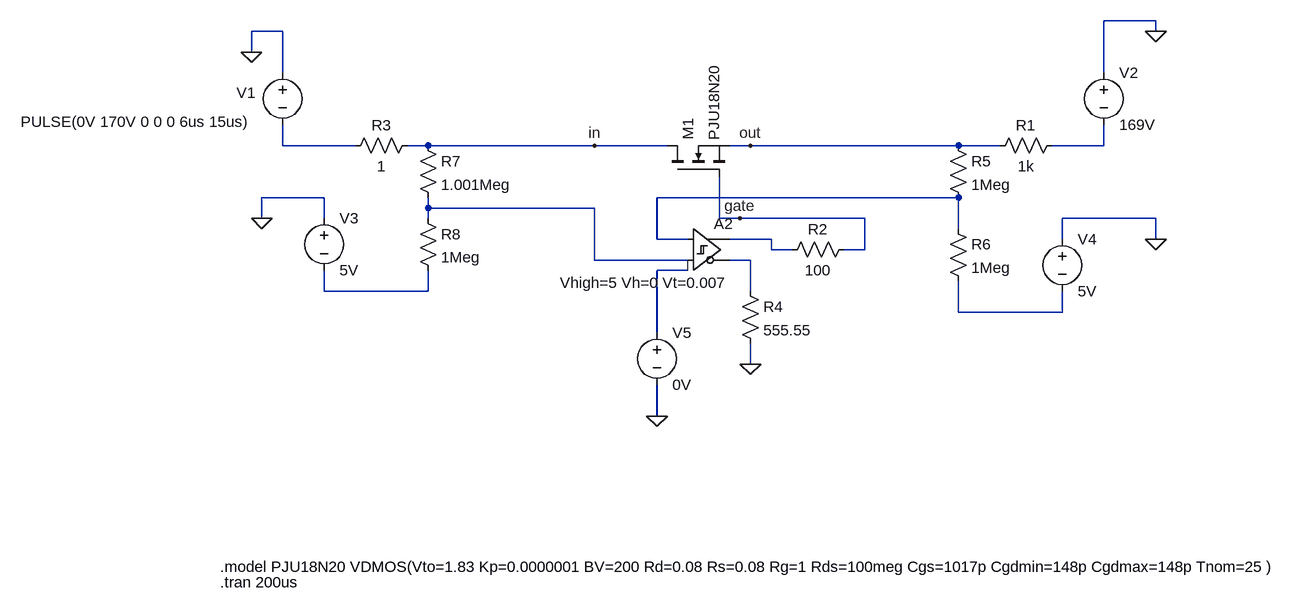
[diagram p0: schematic ideal diode 2.asc]
ideal diode 2.asc, the LTspice schematic file:
Version 4
SHEET 1 2104 680
WIRE 1648 -464 1568 -464
WIRE 304 -448 256 -448
WIRE 1648 -448 1648 -464
WIRE 256 -416 256 -448
WIRE 304 -384 304 -448
WIRE 1568 -384 1568 -464
WIRE 304 -272 304 -304
WIRE 416 -272 304 -272
WIRE 528 -272 496 -272
WIRE 784 -272 528 -272
WIRE 896 -272 784 -272
WIRE 1024 -272 992 -272
WIRE 1344 -272 1024 -272
WIRE 1408 -272 1344 -272
WIRE 1568 -272 1568 -304
WIRE 1568 -272 1488 -272
WIRE 368 -192 272 -192
WIRE 1344 -192 880 -192
WIRE 528 -176 528 -192
WIRE 784 -176 528 -176
WIRE 272 -160 272 -192
WIRE 368 -160 368 -192
WIRE 528 -160 528 -176
WIRE 976 -160 976 -224
WIRE 1008 -160 976 -160
WIRE 1200 -160 1008 -160
WIRE 1648 -160 1504 -160
WIRE 1344 -144 1344 -192
WIRE 880 -128 880 -192
WIRE 928 -128 880 -128
WIRE 1056 -128 992 -128
WIRE 1504 -128 1504 -160
WIRE 1648 -128 1648 -160
WIRE 1056 -112 1056 -128
WIRE 1088 -112 1056 -112
WIRE 1200 -112 1200 -160
WIRE 1200 -112 1168 -112
WIRE 784 -96 784 -176
WIRE 928 -96 784 -96
WIRE 1024 -96 992 -96
WIRE 928 -80 880 -80
WIRE 368 -48 368 -80
WIRE 528 -48 528 -80
WIRE 528 -48 368 -48
WIRE 1024 -48 1024 -96
WIRE 1344 -16 1344 -64
WIRE 1504 -16 1504 -48
WIRE 1504 -16 1344 -16
WIRE 880 16 880 -80
WIRE 1024 64 1024 32
WIRE 880 144 880 96
FLAG 1648 -448 0
FLAG 256 -416 0
FLAG 880 144 0
FLAG 1024 64 0
FLAG 784 -272 in
FLAG 1024 -272 out
FLAG 1008 -160 gate
FLAG 272 -160 0
FLAG 1648 -128 0
SYMBOL nmos 896 -224 R270
SYMATTR InstName M1
SYMATTR Value PJU18N20
SYMBOL res 1504 -288 R90
WINDOW 0 0 56 VBottom 2
WINDOW 3 32 56 VTop 2
SYMATTR InstName R1
SYMATTR Value 1k
SYMBOL voltage 304 -400 R0
WINDOW 0 -71 47 Left 2
WINDOW 3 -403 91 Left 2
WINDOW 123 0 0 Left 0
WINDOW 39 0 0 Left 0
SYMATTR InstName V1
SYMATTR Value PULSE(0V 170V 0 0 0 6us 15us)
SYMBOL voltage 1568 -400 R0
WINDOW 123 0 0 Left 0
WINDOW 39 0 0 Left 0
SYMATTR InstName V2
SYMATTR Value 169V
SYMBOL Digital\\diffschmitt 928 -176 R0
WINDOW 39 -197 115 Left 2
SYMATTR SpiceLine Vhigh=5 Vh=0 Vt=0.007
SYMATTR InstName A2
SYMBOL voltage 880 0 R0
WINDOW 123 0 0 Left 0
WINDOW 39 0 0 Left 0
SYMATTR InstName V5
SYMATTR Value 0V
SYMBOL res 1184 -128 R90
WINDOW 0 0 56 VBottom 2
WINDOW 3 32 56 VTop 2
SYMATTR InstName R2
SYMATTR Value 100
SYMBOL res 512 -288 R90
WINDOW 0 0 56 VBottom 2
WINDOW 3 32 56 VTop 2
SYMATTR InstName R3
SYMATTR Value 1
SYMBOL res 1008 -64 R0
SYMATTR InstName R4
SYMATTR Value 555.55
SYMBOL res 512 -288 R0
SYMATTR InstName R7
SYMATTR Value 1.001Meg
SYMBOL res 512 -176 R0
SYMATTR InstName R8
SYMATTR Value 1Meg
SYMBOL voltage 368 -176 R0
WINDOW 123 0 0 Left 0
WINDOW 39 0 0 Left 0
SYMATTR InstName V3
SYMATTR Value 5V
SYMBOL res 1328 -288 R0
SYMATTR InstName R5
SYMATTR Value 1Meg
SYMBOL res 1328 -160 R0
SYMATTR InstName R6
SYMATTR Value 1Meg
SYMBOL voltage 1504 -144 R0
WINDOW 123 0 0 Left 0
WINDOW 39 0 0 Left 0
SYMATTR InstName V4
SYMATTR Value 5V
TEXT 208 376 Left 2 !.model PJU18N20 VDMOS(Vto=1.83 Kp=0.0000001 BV=200 Rd=0.08 Rs=0.08 Rg=1 Rds=100meg Cgs=1017p Cgdmin=148p Cgdmax=148p Tnom=25 )
TEXT 208 400 Left 2 !.tran 200us

The netlist it stands for:
* ideal diode 2.asc
M1 in gate out out PJU18N20
R1 N002 out 1k
V1 0 N001 PULSE(0V 170V 0 0 0 6us 15us)
V2 0 N002 169V
A2 N003 N004 N007 N007 N007 N006 N005 N007 SCHMITT Vhigh=5 Vh=0 Vt=0.007
V5 N007 0 0V
R2 gate N005 100
R3 in N001 1
R4 N006 0 555.55
R7 in N004 1.001Meg
R8 N004 N008 1Meg
V3 0 N008 5V
R5 out N003 1Meg
R6 N003 N009 1Meg
V4 0 N009 5V
.model NMOS NMOS
.model PMOS PMOS
.lib standard.mos
.model PJU18N20 VDMOS(Vto=1.83 Kp=0.0000001 BV=200 Rd=0.08 Rs=0.08 Rg=1 Rds=100meg Cgs=1017p Cgdmin=148p Cgdmax=148p Tnom=25 )
.tran 200us
.backanno
.end